# Altium schematic sheet PATHOS_ControllerBoardInterface.SchDoc: Connector to Controller Board
size A4; Author: A. Kalberer; CompanyName: NTB; Organization: NTB Interstate University of Applied; Address1: Werdenbergstrasse 4; Address3: 9471 Buchs; Address4: Switzerland; DocumentNumber: 5; Revision: 0.1; SheetNumber: 5; SheetTotal: 5; Organization1: Sciences of Technology Buchs; Size: A4; ShortDescription: + PowerSupply for 3.3V and 5V from Controller Board
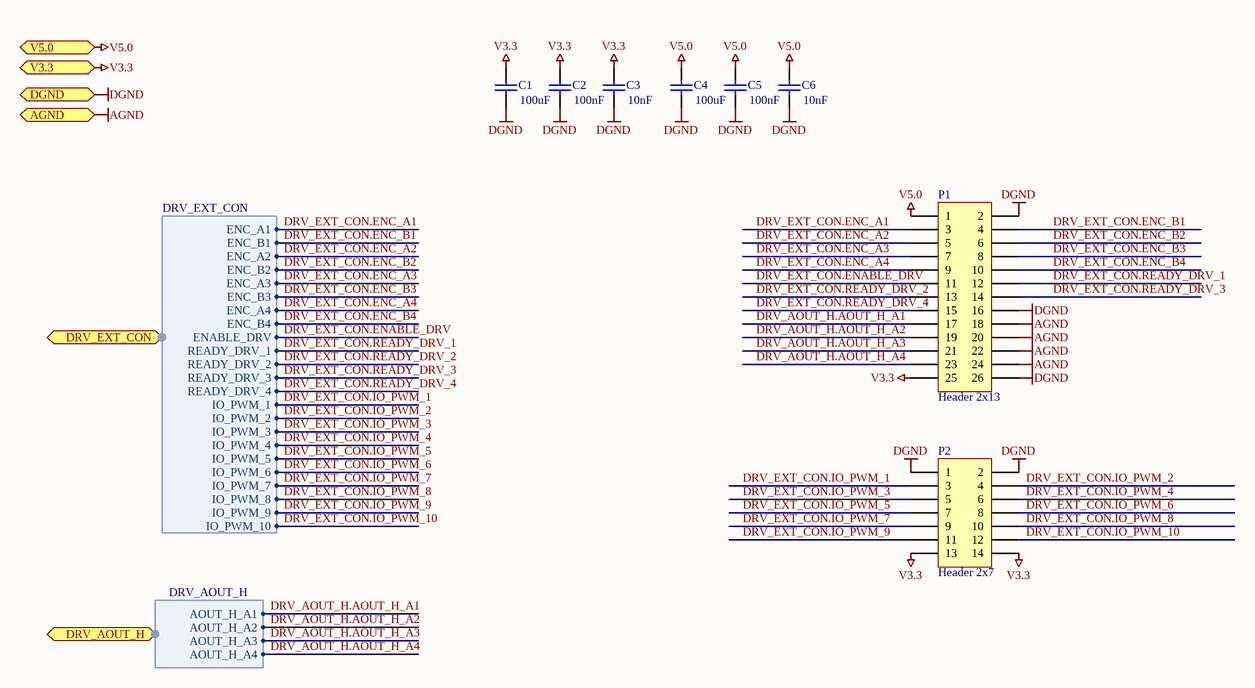
[diagram p0: PATHOS_ControllerBoardInterface.SchDoc]

## Parts
C1  value 100uF  [1812]  (hidden comment: Cap)
C2  value 100nF  [0603_3D]  (hidden comment: Cap)
C3  value 10nF  [0603_3D]  (hidden comment: Cap)
C4  value 100uF  [1812]  (hidden comment: Cap)
C5  value 100nF  [0603_3D]  (hidden comment: Cap)
C6  value 10nF  [0603_3D]  (hidden comment: Cap)
P1  Header 2x13  [Wannenstecker26Pol]
P2  Header 2x7  [Wannenstecker14Pol]

## Ports
AGND, DGND, DRV_AOUT_H (harness DRV_AOUT_H), DRV_EXT_CON (harness DRV_EXT_CON), V3.3, V5.0

## Harnesses
DRV_EXT_CON: ENC_A1, ENC_B1, ENC_A2, ENC_B2, ENC_A3, ENC_B3, ENC_A4, ENC_B4, ENABLE_DRV, IO_PWM_1, IO_PWM_2, IO_PWM_3, IO_PWM_4, IO_PWM_5, IO_PWM_6, IO_PWM_7, IO_PWM_8, READY_DRV_1, READY_DRV_2, READY_DRV_3, READY_DRV_4, IO_PWM_9, IO_PWM_10
DRV_AOUT_H: AOUT_H_A1, AOUT_H_A2, AOUT_H_A3, AOUT_H_A4

## Nets
AGND: P1.18 P1.20 P1.22 P1.24 ; port AGND
DGND: C1.1 C2.1 C3.1 C4.1 C5.1 C6.1 P1.2 P1.16 P1.26 P2.1 P2.2 ; port DGND
V3.3: C1.2 C2.2 C3.2 P1.25 P2.13 P2.14 ; port V3.3
V5.0: C4.2 C5.2 C6.2 P1.1 ; port V5.0
DRV_AOUT_H.AOUT_H_A1: P1.17 ; port DRV_AOUT_H.AOUT_H_A1
DRV_AOUT_H.AOUT_H_A2: P1.19 ; port DRV_AOUT_H.AOUT_H_A2
DRV_AOUT_H.AOUT_H_A3: P1.21 ; port DRV_AOUT_H.AOUT_H_A3
DRV_AOUT_H.AOUT_H_A4: P1.23 ; port DRV_AOUT_H.AOUT_H_A4
DRV_EXT_CON.ENABLE_DRV: P1.11 ; port DRV_EXT_CON.ENABLE_DRV
DRV_EXT_CON.ENC_A1: P1.3 ; port DRV_EXT_CON.ENC_A1
DRV_EXT_CON.ENC_A2: P1.5 ; port DRV_EXT_CON.ENC_A2
DRV_EXT_CON.ENC_A3: P1.7 ; port DRV_EXT_CON.ENC_A3
DRV_EXT_CON.ENC_A4: P1.9 ; port DRV_EXT_CON.ENC_A4
DRV_EXT_CON.ENC_B1: P1.4 ; port DRV_EXT_CON.ENC_B1
DRV_EXT_CON.ENC_B2: P1.6 ; port DRV_EXT_CON.ENC_B2
DRV_EXT_CON.ENC_B3: P1.8 ; port DRV_EXT_CON.ENC_B3
DRV_EXT_CON.ENC_B4: P1.10 ; port DRV_EXT_CON.ENC_B4
DRV_EXT_CON.IO_PWM_1: P2.3 ; port DRV_EXT_CON.IO_PWM_1
DRV_EXT_CON.IO_PWM_2: P2.4 ; port DRV_EXT_CON.IO_PWM_2
DRV_EXT_CON.IO_PWM_3: P2.5 ; port DRV_EXT_CON.IO_PWM_3
DRV_EXT_CON.IO_PWM_4: P2.6 ; port DRV_EXT_CON.IO_PWM_4
DRV_EXT_CON.IO_PWM_5: P2.7 ; port DRV_EXT_CON.IO_PWM_5
DRV_EXT_CON.IO_PWM_6: P2.8 ; port DRV_EXT_CON.IO_PWM_6
DRV_EXT_CON.IO_PWM_7: P2.9 ; port DRV_EXT_CON.IO_PWM_7
DRV_EXT_CON.IO_PWM_8: P2.10 ; port DRV_EXT_CON.IO_PWM_8
DRV_EXT_CON.IO_PWM_9: P2.11 ; port DRV_EXT_CON.IO_PWM_9
DRV_EXT_CON.IO_PWM_10: P2.12 ; port DRV_EXT_CON.IO_PWM_10
DRV_EXT_CON.READY_DRV_1: P1.12 ; port DRV_EXT_CON.READY_DRV_1
DRV_EXT_CON.READY_DRV_2: P1.13 ; port DRV_EXT_CON.READY_DRV_2
DRV_EXT_CON.READY_DRV_3: P1.14 ; port DRV_EXT_CON.READY_DRV_3
DRV_EXT_CON.READY_DRV_4: P1.15 ; port DRV_EXT_CON.READY_DRV_4

## Notes on the sheet
- Title:
- Description:
- Size:
- Date:
- Name:
- Number:
- Time:
- Revision:
- Sheet
- Checked:
- of
- File:

## Library data of the parts
C1-C6 = Cap: Capacitor; Published: 8-Jun-2000; LatestRevisionDate: 17-Jul-2002; LatestRevisionNote: Re-released for DXP Platform.; PackageReference: RAD-0.3; Publisher: Altium Limited; PackageDescription: Radial Cap, Thru-Hole; 2 Leads; 0.3 in Pin Spacing
P1 = Header 2x13: Header, 13-Pin, Dual row; LatestRevisionDate: 17-Jul-2002; LatestRevisionNote: Re-released for DXP Platform.; Publisher: Altium Limited
P2 = Header 2x7: Header, 7-Pin, Dual row; LatestRevisionDate: 17-Jul-2002; LatestRevisionNote: Re-released for DXP Platform.; Publisher: Altium Limited